# Altium schematic sheet fpga_misc.SchDoc
size A4
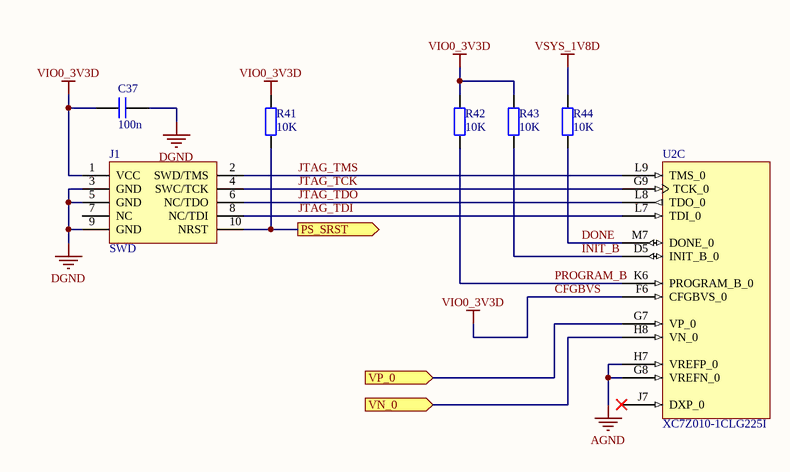
[diagram p0: fpga_misc.SchDoc]

## Parts
C37  value 100n  [CAPC1005X06N]  (hidden comment: cap)
J1  SWD  [hdr_2x5_50mil]
R41  value 10K  [RESC1005X04N]  (hidden comment: res)
R42  value 10K  [RESC1005X04N]  (hidden comment: res)
R43  value 10K  [RESC1005X04N]  (hidden comment: res)
R44  value 10K  [RESC1005X04N]  (hidden comment: res)
U2  XC7Z010-1CLG225I  [CLG225]  (part C of 8)

## Ports
PS_SRST (out), VN_0 (in), VP_0 (in)

## Nets
AGND: U2.G8(VREFN_0) U2.H7(VREFP_0)
CFGBVS: C37.1 J1.1(VCC) R41.2 R42.2 R43.2 U2.F6(CFGBVS_0)  [also labelled VIO0_3V3D]
DGND: C37.2 J1.3(GND) J1.5(GND) J1.9(GND)
VSYS_1V8D: R44.2
DONE: R44.1 U2.M7(DONE_0)
INIT_B: R43.1 U2.D5(INIT_B_0)
JTAG_TCK: J1.4(SWC/TCK) U2.G9(TCK_0)
JTAG_TDI: J1.8(NC/TDI) U2.L7(TDI_0)
JTAG_TDO: J1.6(NC/TDO) U2.L8(TDO_0)
JTAG_TMS: J1.2(SWD/TMS) U2.L9(TMS_0)
PROGRAM_B: R42.1 U2.K6(PROGRAM_B_0)
PS_SRST: J1.10(NRST) R41.1 ; port PS_SRST
VN_0: U2.H8(VN_0) ; port VN_0
VP_0: U2.G7(VP_0) ; port VP_0

Not connected (* = marked no-connect by the designer): J1 7(NC); U2 J7(DXP_0)*

## Library data of the parts
C37 = cap: Capacitor; voltage: *; type: *; #digikey: *; #mouser: *
J1 = hdr_swd: SWD Header
R41-R44 = res: Resistor; power: *; voltage: *; #digikey: *; #mouser: *
U2 = CMP-0382-00001-1: 667 MHz Zynq™-7000 AP SoC, 88 PS I/O, 54 FPGA I/O, 225-Ball BGA, Speed Grade 1, Industrial Grade, Pb-Free; LUTs: 17600; Extensible Block RAM (# 36Kb Blocks): 240 KB (60); Speed Grade: -1; Flip Flops: 35200; DatasheetVersion: v1.2; ComponentLink4Description: Package File; ComponentLink1URL: http://www.xilinx.com/support/documentation/data_sheets/ds190-Zynq-7000-Overview.pdf; ComponentLink5URL: http://www.xilinx.com/support/documentation/user_guides/ug865-Zynq-7000-Pkg-Pinout.pdf; ComponentLink5Description: Packaging and Pinout; PartNumber: XC7Z010-1CLG225I; PackageVersion: Rev 1.2, 02/2013; ComponentLink3Description: DC and AC Switching Characteristics; ComponentLink2URL: http://www.xilinx.com/support/documentation/user_guides/ug865-Zynq-7000-Pkg-Pinout.pdf; ComponentLink3URL: http://www.xilinx.com/support/documentation/data_sheets/ds187-XC7Z010-XC7Z020-Data-Sheet.pdf; ComponentLink6URL: http://www.xilinx.com/support/documentation/user_guides/ug483_7Series_PCB.pdf; ComponentLink2Description: Package Specification; PackageReference: CLG225; ComponentLink1Description: Datasheet; ComponentLink4URL: http://www.xilinx.com/support/packagefiles/z7packages/xc7z010clg225pkg.txt; Generic Part Number: XC7Z010; ComponentLink6Description: PCB and Layout Guide; Mounting Technology: Surface Mount; PackageDescription: Wire-Bond Chip-Scale BGA, Body 13 x 13 mm, 0.8 mm Pitch; Code_JEDEC: MO-275-HHAC-1; RoHS: Pb-Free